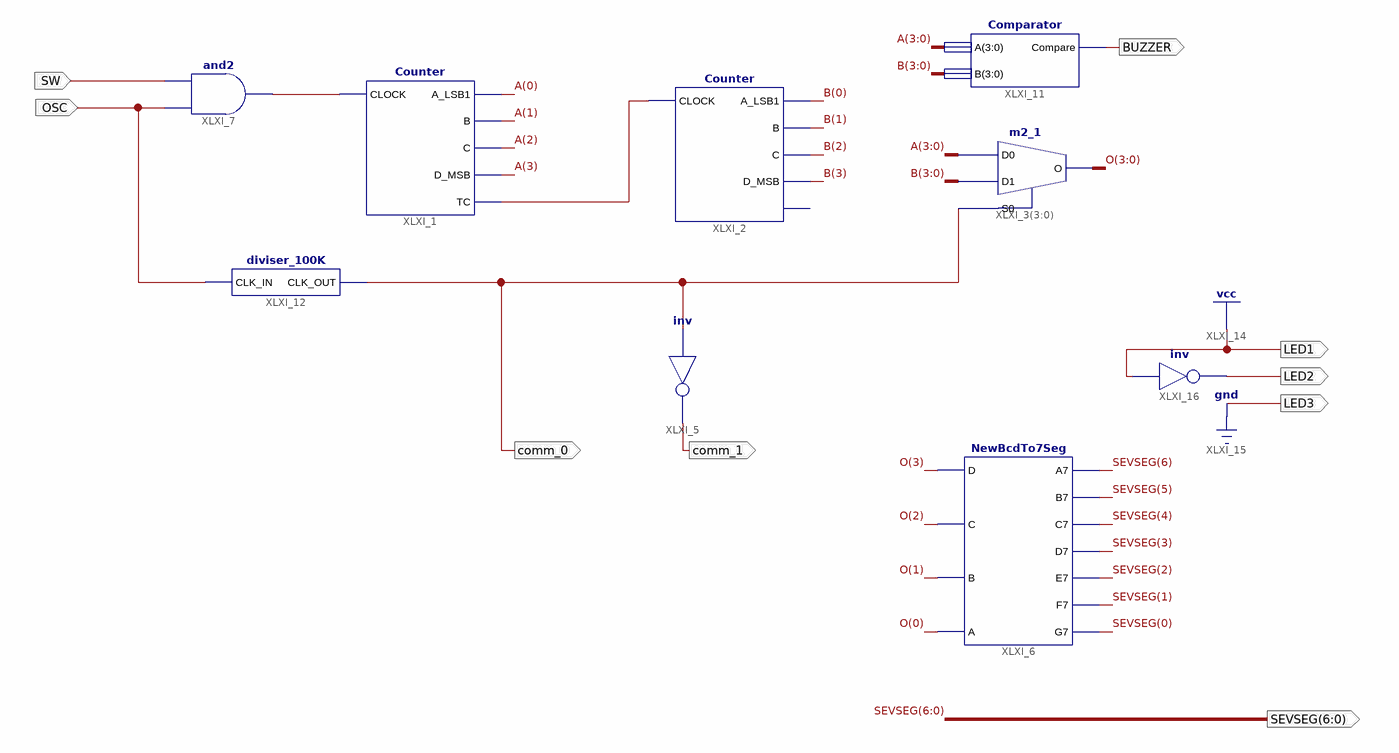
[diagram p0: schematic sheet 1]
// Xilinx ISE schematic clock.sch (spartan6) as structural Verilog: 9 symbols, 9 ports
module clock (
  input  OSC,
  input  SW,
  output [6:0] SEVSEG,
  output BUZZER,
  output LED1,
  output LED2,
  output LED3,
  output comm_1,
  output comm_0
);

  wire XLXN_11, XLXN_41;
  wire [3:0] A, B, O;

  Counter XLXI_1 (.CLOCK(XLXN_41), .D_MSB(A[3]), .B(A[1]), .TC(XLXN_11), .A_LSB1(A[0]), .C(A[2]));
  Counter XLXI_2 (.CLOCK(XLXN_11), .D_MSB(B[3]), .B(B[1]), .A_LSB1(B[0]), .C(B[2]));  // open: TC
  m2_1 XLXI_3[3:0] (.D0(A), .D1(B), .S0(comm_0), .O(O));
  NewBcdTo7Seg XLXI_6 (
    .D(O[3]), .C(O[2]), .B(O[1]), .A(O[0]), .A7(SEVSEG[6]), .B7(SEVSEG[5]), .C7(SEVSEG[4]), .D7(SEVSEG[3]),
    .E7(SEVSEG[2]), .F7(SEVSEG[1]), .G7(SEVSEG[0]));
  and XLXI_7 (XLXN_41, OSC, SW);
  Comparator XLXI_11 (.A(A), .B(B), .Compare(BUZZER));
  diviser_100K XLXI_12 (.CLK_IN(OSC), .CLK_OUT(comm_0));
  not XLXI_16 (LED2, 1'b1);
  not XLXI_5 (comm_1, comm_0);

  assign LED1 = 1'b1;
  assign LED3 = 1'b0;
endmodule
